# EAGLE design bus-wiring (EAGLE 5.11)
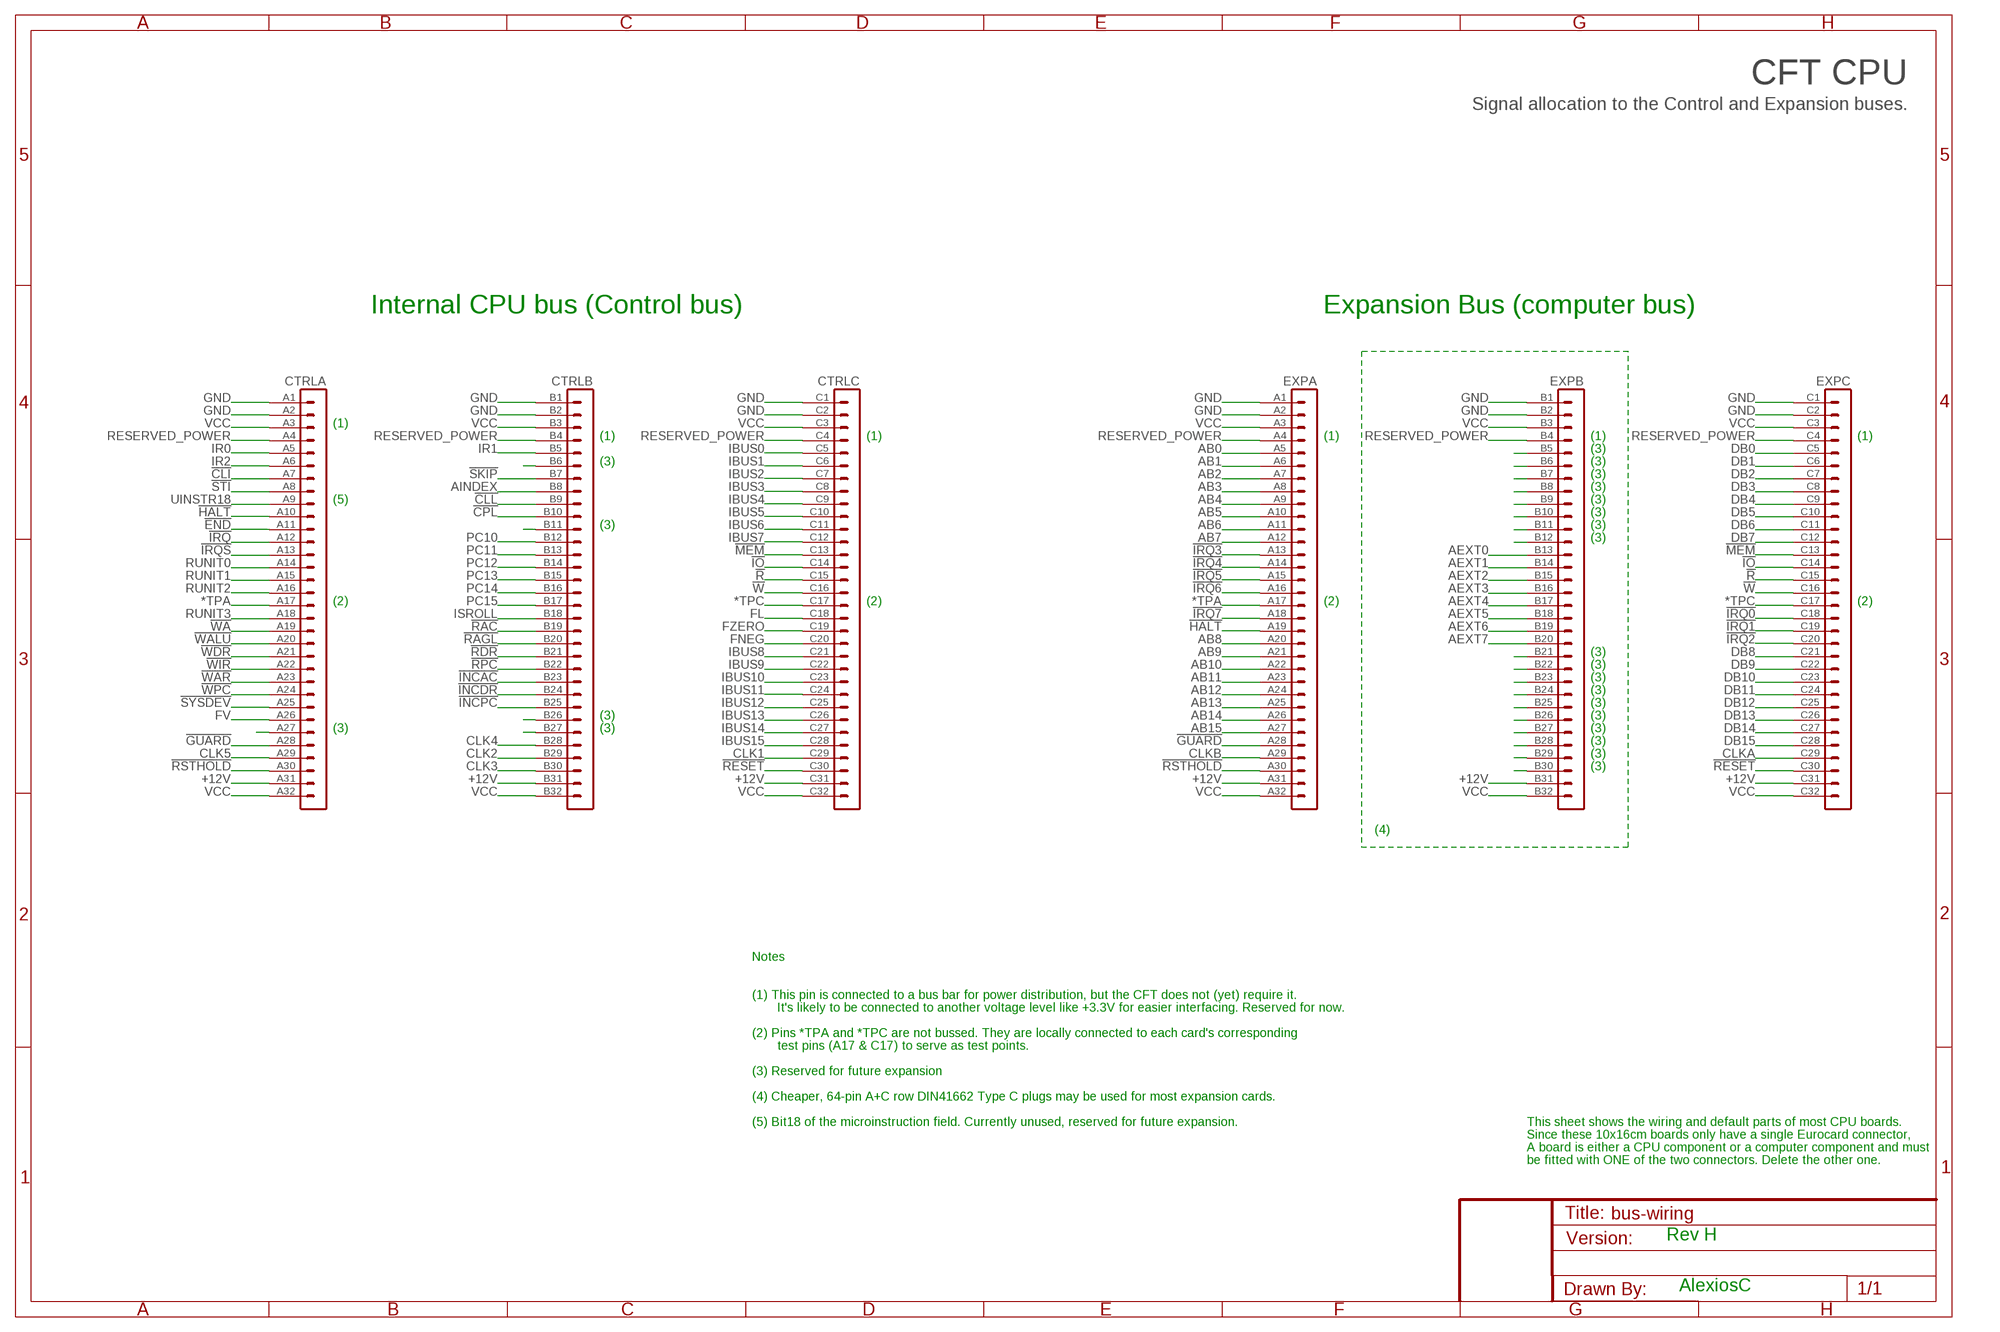
[diagram p0: schematic, sheet 1]

## Parts
CTRL  VG96-3B  [VG96B]
EXP  VG96-3B  [VG96B]

## Nets
!CLI: CTRL.A7
!CLL: CTRL.B9
!CPL: CTRL.B10
!END: CTRL.A11
!GUARD: CTRL.A28 EXP.A28
!HALT: CTRL.A10 EXP.A19
!INCAC: CTRL.B23
!INCDR: CTRL.B24
!INCPC: CTRL.B25
!IO: CTRL.C14 EXP.C14
!IRQ: CTRL.A12
!IRQ0: EXP.C18
!IRQ1: EXP.C19
!IRQ2: EXP.C20
!IRQ3: EXP.A13
!IRQ4: EXP.A14
!IRQ5: EXP.A15
!IRQ6: EXP.A16
!IRQ7: EXP.A18
!IRQS: CTRL.A13
!MEM: CTRL.C13 EXP.C13
!R: CTRL.C15 EXP.C15
!RAC: CTRL.B19
!RAGL: CTRL.B20
!RDR: CTRL.B21
!RESET: CTRL.C30 EXP.C30
!RPC: CTRL.B22
!RSTHOLD: CTRL.A30 EXP.A30
!SKIP: CTRL.B7
!STI: CTRL.A8
!SYSDEV: CTRL.A25
!W: CTRL.C16 EXP.C16
!WA: CTRL.A19
!WALU: CTRL.A20
!WAR: CTRL.A23
!WDR: CTRL.A21
!WIR: CTRL.A22
!WPC: CTRL.A24
*TPA: CTRL.A17 EXP.A17
*TPC: CTRL.C17 EXP.C17
+12V [12V]: CTRL.A31 CTRL.B31 CTRL.C31 EXP.A31 EXP.B31 EXP.C31
AB0: EXP.A5
AB1: EXP.A6
AB2: EXP.A7
AB3: EXP.A8
AB4: EXP.A9
AB5: EXP.A10
AB6: EXP.A11
AB7: EXP.A12
AB8: EXP.A20
AB9: EXP.A21
AB10: EXP.A22
AB11: EXP.A23
AB12: EXP.A24
AB13: EXP.A25
AB14: EXP.A26
AB15: EXP.A27
AEXT0: EXP.B13
AEXT1: EXP.B14
AEXT2: EXP.B15
AEXT3: EXP.B16
AEXT4: EXP.B17
AEXT5: EXP.B18
AEXT6: EXP.B19
AEXT7: EXP.B20
AINDEX: CTRL.B8
CLK1: CTRL.C29
CLK2: CTRL.B29
CLK3: CTRL.B30
CLK4: CTRL.B28
CLK5: CTRL.A29
CLKA: EXP.C29
CLKB: EXP.A29
DB0: EXP.C5
DB1: EXP.C6
DB2: EXP.C7
DB3: EXP.C8
DB4: EXP.C9
DB5: EXP.C10
DB6: EXP.C11
DB7: EXP.C12
DB8: EXP.C21
DB9: EXP.C22
DB10: EXP.C23
DB11: EXP.C24
DB12: EXP.C25
DB13: EXP.C26
DB14: EXP.C27
DB15: EXP.C28
FL: CTRL.C18
FNEG: CTRL.C20
FV: CTRL.A26
FZERO: CTRL.C19
GND: CTRL.A1 CTRL.A2 CTRL.B1 CTRL.B2 CTRL.C1 CTRL.C2 EXP.A1 EXP.A2 EXP.B1 EXP.B2 EXP.C1 EXP.C2
IBUS0: CTRL.C5
IBUS1: CTRL.C6
IBUS2: CTRL.C7
IBUS3: CTRL.C8
IBUS4: CTRL.C9
IBUS5: CTRL.C10
IBUS6: CTRL.C11
IBUS7: CTRL.C12
IBUS8: CTRL.C21
IBUS9: CTRL.C22
IBUS10: CTRL.C23
IBUS11: CTRL.C24
IBUS12: CTRL.C25
IBUS13: CTRL.C26
IBUS14: CTRL.C27
IBUS15: CTRL.C28
IR0: CTRL.A5
IR1: CTRL.B5
IR2: CTRL.A6
ISROLL: CTRL.B18
N$1: EXP.B12
N$2: EXP.B11
N$3: EXP.B10
N$4: EXP.B9
N$5: EXP.B8
N$8: EXP.B7
N$9: EXP.B6
N$10: EXP.B5
N$11: EXP.B28
N$12: EXP.B27
N$13: EXP.B26
N$15: EXP.B25
N$16: EXP.B24
N$17: EXP.B23
N$18: EXP.B22
N$19: EXP.B21
N$20: EXP.B29
N$21: EXP.B30
N$22: CTRL.B27
N$23: CTRL.B6
N$25: CTRL.A27
N$26: CTRL.B26
N$47: CTRL.B11
PC10: CTRL.B12
PC11: CTRL.B13
PC12: CTRL.B14
PC13: CTRL.B15
PC14: CTRL.B16
PC15: CTRL.B17
RESERVED_POWER: CTRL.A4 CTRL.B4 CTRL.C4 EXP.A4 EXP.B4 EXP.C4
RUNIT0: CTRL.A14
RUNIT1: CTRL.A15
RUNIT2: CTRL.A16
RUNIT3: CTRL.A18
UINSTR18: CTRL.A9
VCC: CTRL.A3 CTRL.A32 CTRL.B3 CTRL.B32 CTRL.C3 CTRL.C32 EXP.A3 EXP.A32 EXP.B3 EXP.B32 EXP.C3 EXP.C32

## Notes on the sheet
- CFT CPU
- Signal allocation to the Control and Expansion buses.
- Internal CPU bus (Control bus) | Expansion Bus (computer bus)
- (1)
- (1) | (1) | (1) | (1) | (1)
- (3)
- (3) | (3)
- (3)
- (3)
- (5) | (3)
- (3)
- (3) | (3)
- (3)
- (2) | (2) | (2) | (2)
- (3)
- (3)
- (3)
- (3)
- (3)
- (3) | (3)
- (3) | (3) | (3)
- (3)
- (3)
- (3)
- (4)
- Notes
- (1) This pin is connected to a bus bar for power distribution, but the CFT does not (yet) require it.
- It's likely to be connected to another voltage level like +3.3V for easier interfacing. Reserved for now.
- (2) Pins *TPA and *TPC are not bussed. They are locally connected to each card's corresponding
- test pins (A17 & C17) to serve as test points.
- (3) Reserved for future expansion
- (4) Cheaper, 64-pin A+C row DIN41662 Type C plugs may be used for most expansion cards.
- (5) Bit18 of the microinstruction field. Currently unused, reserved for future expansion. | This sheet shows the wiring and default parts of most CPU boards.
- Since these 10x16cm boards only have a single Eurocard connector,
- A board is either a CPU component or a computer component and must
- be fitted with ONE of the two connectors. Delete the other one.
- Rev H
- AlexiosC

## Library data of the parts
CTRL EXP = 19inch:VG96-3: PCB EUROCARD, 96-pin type C/ABC, 2.54 mm

## Net classes
0 default: width 0.305 mm, clearance 0.254 mm
1 Power: width 0.635 mm, clearance 0.254 mm
2 12V: width 0.635 mm, clearance 0.635 mm

## Board
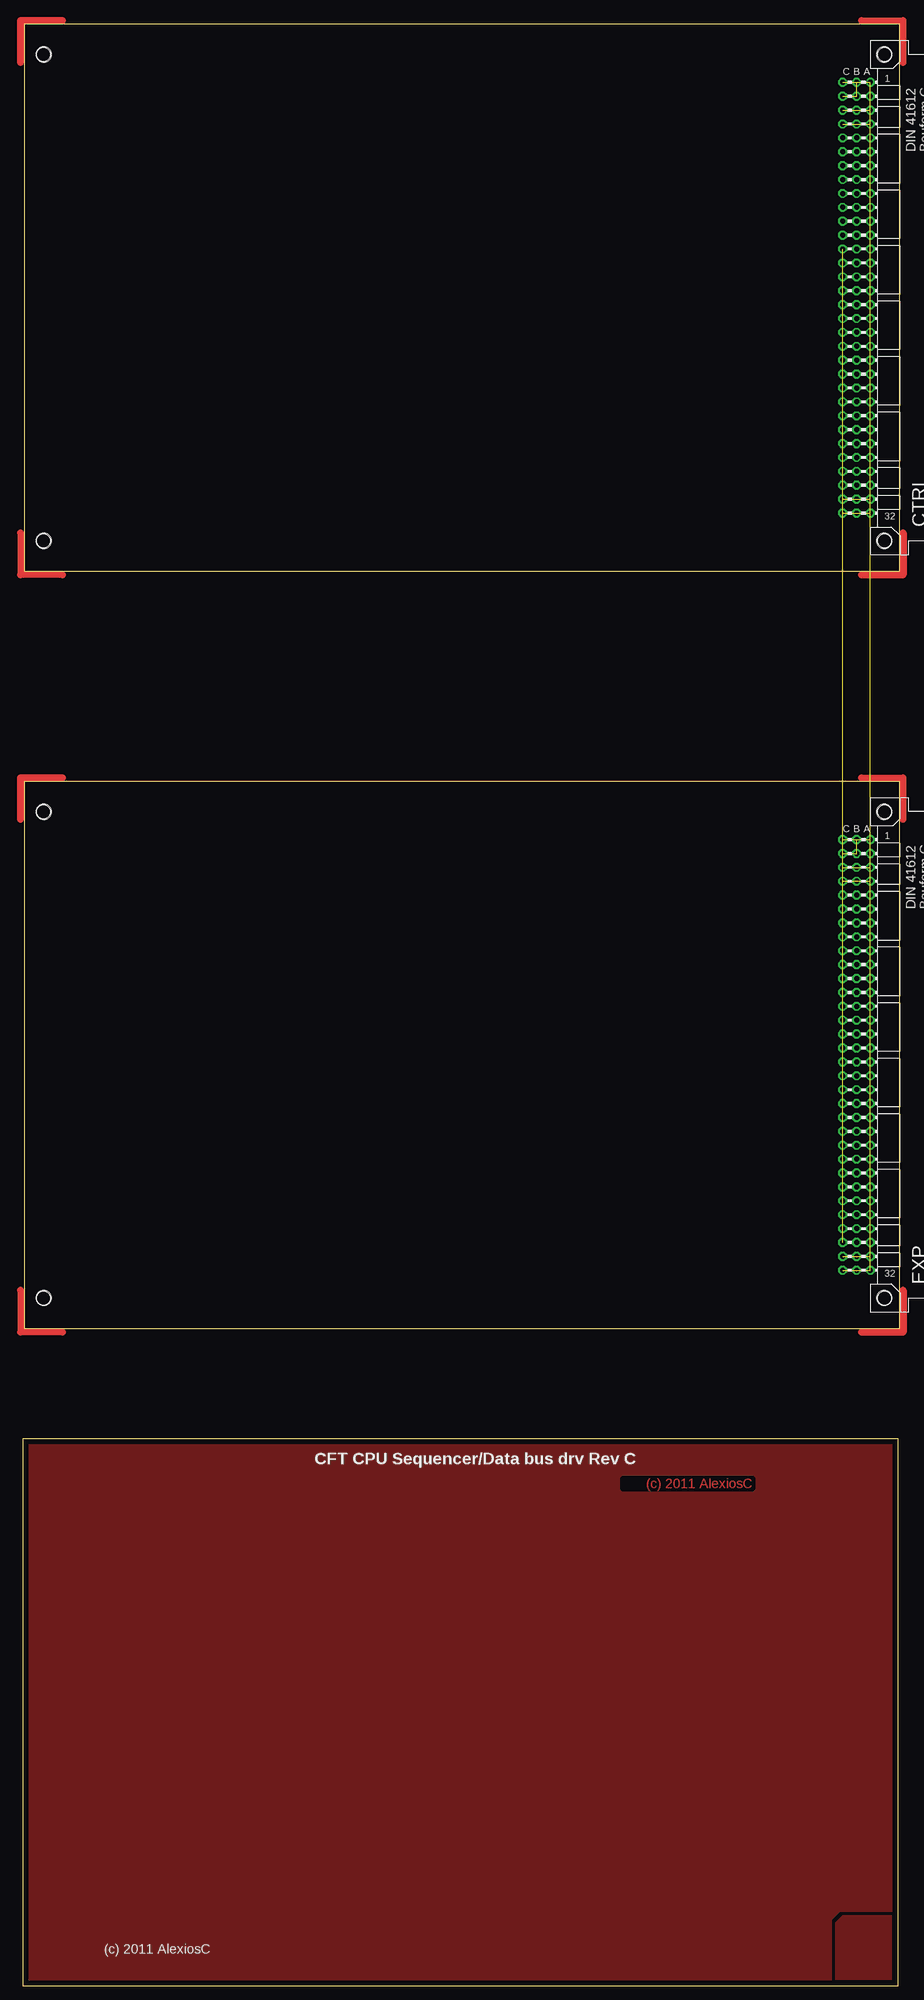
[diagram p1: board, top side]
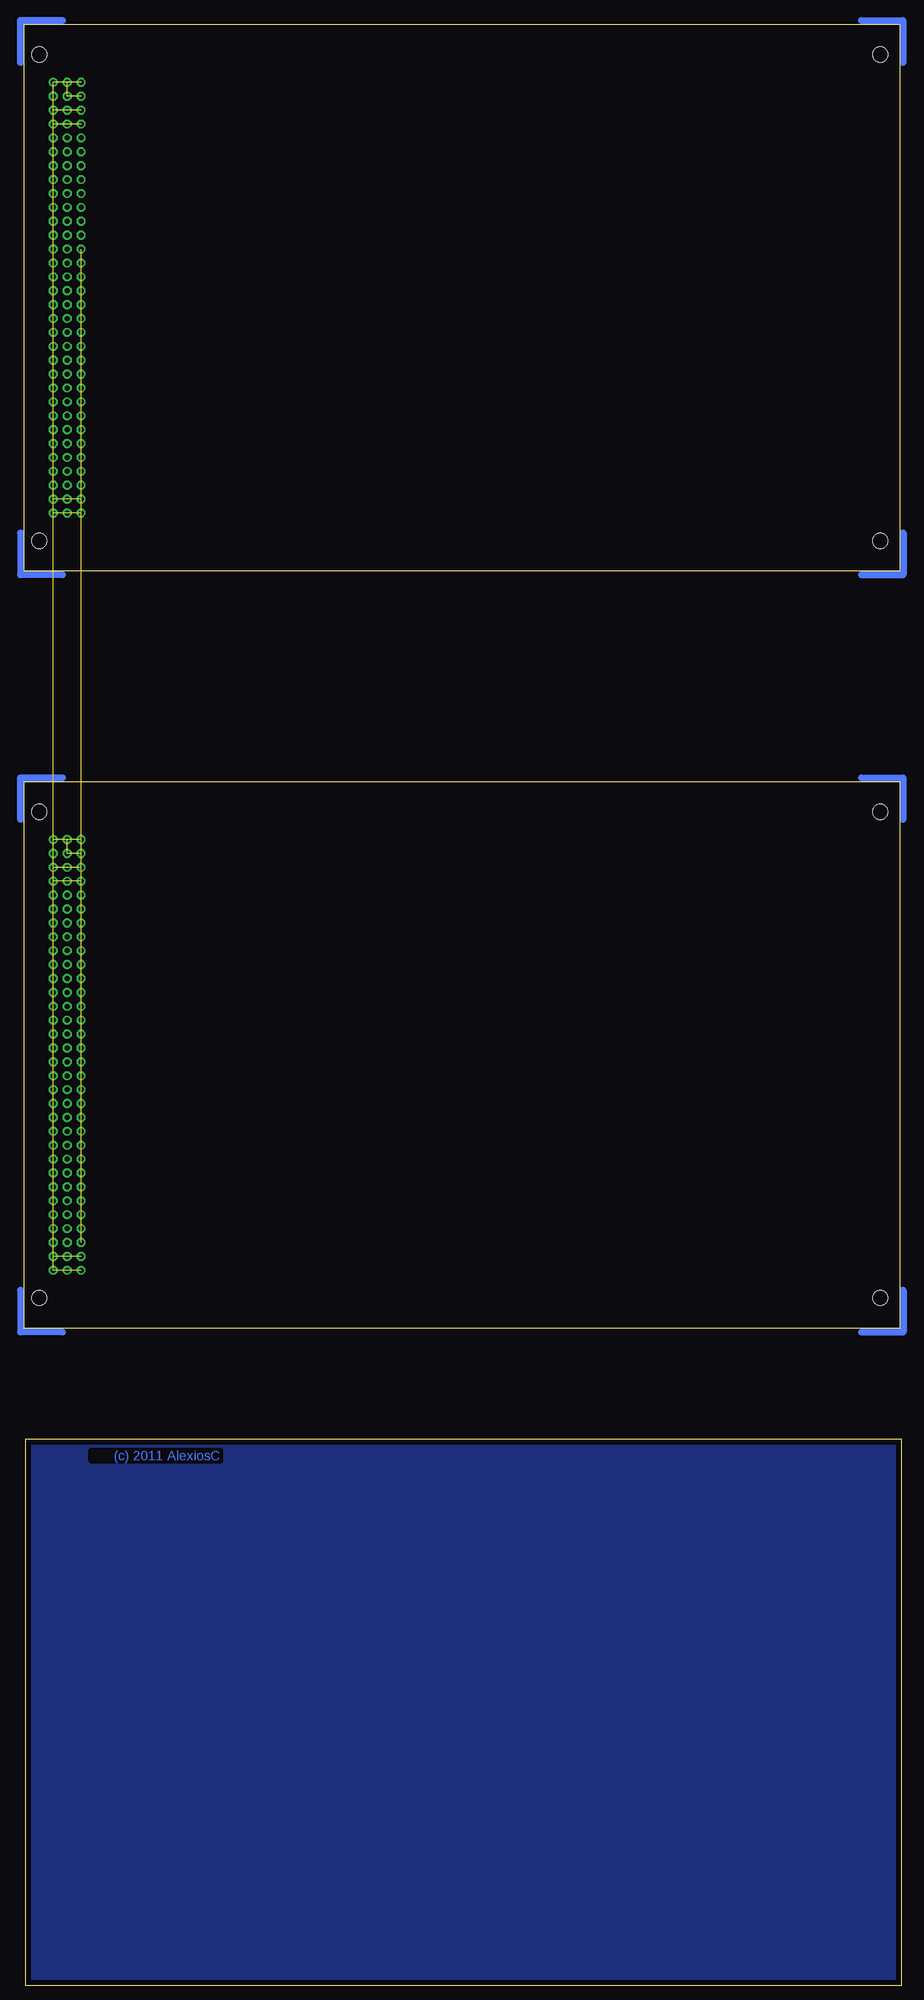
[diagram p2: board, bottom side, seen from below]

Size 160.27 x 358.62 mm. Coordinates in mm from the lower left corner, seen from the top.
Outline: 0,0 160,0 160,100 0,100 0,0
Copper layers (1*16): Top 0.035mm / dielectric 1.5mm / Bottom 0.035mm
Design rules "olimex-10mil": minimum track width 10mil, minimum drill 24mil, track to track 10mil, track to pad 10mil, pad to pad 10mil, via to via 10mil, smd to smd 10mil, copper to edge 40mil, drill to drill 10mil, minimum pad ring 10mil, minimum via ring 8mil, stop-mask expansion 0mil, vias tented up to drill 0mil, thermal gap 10mil

### Footprints (pad centres in the part's own frame; a part is rotated, then mirrored left to right if it is on the bottom)
VG96B = drill 0.914 pad 1.6 round: A1 154.94,39.37 | drill 0.914 pad 1.6 octagon: A2 154.94,36.83; A3 154.94,34.29; A4 154.94,31.75; A5 154.94,29.21; A6 154.94,26.67; A7 154.94,24.13; A8 154.94,21.59; A9 154.94,19.05; A10 154.94,16.51; A11 154.94,13.97; A12 154.94,11.43; A13 154.94,8.89; A14 154.94,6.35; A15 154.94,3.81; A16 154.94,1.27; A17 154.94,-1.27; A18 154.94,-3.81; A19 154.94,-6.35; A20 154.94,-8.89; A21 154.94,-11.43; A22 154.94,-13.97; A23 154.94,-16.51; A24 154.94,-19.05; A25 154.94,-21.59; A26 154.94,-24.13; A27 154.94,-26.67; A28 154.94,-29.21; A29 154.94,-31.75; A30 154.94,-34.29; A31 154.94,-36.83; A32 154.94,-39.37; B1 152.4,39.37; B2 152.4,36.83; B3 152.4,34.29; B4 152.4,31.75; B5 152.4,29.21; B6 152.4,26.67; B7 152.4,24.13; B8 152.4,21.59; B9 152.4,19.05; B10 152.4,16.51; B11 152.4,13.97; B12 152.4,11.43; B13 152.4,8.89; B14 152.4,6.35; B15 152.4,3.81; B16 152.4,1.27; B17 152.4,-1.27; B18 152.4,-3.81; B19 152.4,-6.35; B20 152.4,-8.89; B21 152.4,-11.43; B22 152.4,-13.97; B23 152.4,-16.51; B24 152.4,-19.05; B25 152.4,-21.59; B26 152.4,-24.13; B27 152.4,-26.67; B28 152.4,-29.21; B29 152.4,-31.75; B30 152.4,-34.29; B31 152.4,-36.83; B32 152.4,-39.37; C1 149.86,39.37; C2 149.86,36.83; C3 149.86,34.29; C4 149.86,31.75; C5 149.86,29.21; C6 149.86,26.67; C7 149.86,24.13; C8 149.86,21.59; C9 149.86,19.05; C10 149.86,16.51; C11 149.86,13.97; C12 149.86,11.43; C13 149.86,8.89; C14 149.86,6.35; C15 149.86,3.81; C16 149.86,1.27; C17 149.86,-1.27; C18 149.86,-3.81; C19 149.86,-6.35; C20 149.86,-8.89; C21 149.86,-11.43; C22 149.86,-13.97; C23 149.86,-16.51; C24 149.86,-19.05; C25 149.86,-21.59; C26 149.86,-24.13; C27 149.86,-26.67; C28 149.86,-29.21; C29 149.86,-31.75; C30 149.86,-34.29; C31 149.86,-36.83; C32 149.86,-39.37 | hole 2.794: 157.48,44.45; 157.48,-44.45; 3.81,44.45; 3.81,-44.45

### Placement (x,y rotation side)
CTRL  0,308.61 0 top
EXP  0,170.18 0 top

### Tracks (layer width: path | path; a pad name or v marks a point on that pad's centre or on a via)
!GUARD  (1 unrouted)
!HALT  (1 unrouted)
!IO  (1 unrouted)
!MEM  (1 unrouted)
!R  (1 unrouted)
!RESET  (1 unrouted)
!RSTHOLD  (1 unrouted)
!W  (1 unrouted)
*TPA  (1 unrouted)
*TPC  (1 unrouted)
+12V  (5 unrouted)
  pour Top (isolate 0.635, no thermals): 148.59,11.43 148.59,1.27 158.75,1.27 158.75,12.7 149.86,12.7
GND  (11 unrouted)
  pour Bottom (isolate 0.508, no thermals): 30.48,8.89 29.21,7.62 29.21,5.08 30.48,3.81 33.02,3.81 34.29,5.08 34.29,7.62 33.02,8.89
  pour Bottom (isolate 0.61, no thermals): 0,100.33 0,0 160.02,0 160.02,100.33
RESERVED_POWER  (5 unrouted)
VCC  (11 unrouted)
  pour Top (isolate 0.508, no thermals): 20.32,8.89 19.05,7.62 19.05,5.08 20.32,3.81 22.86,3.81 24.13,5.08 24.13,7.62 22.86,8.89
  pour Top (isolate 0.61, rank 2, no thermals): 0,100.33 0,0 160.02,0 160.02,100.33

### Text on the board
Top: (c) 2011 AlexiosC
Bottom: (c) 2011 AlexiosC
tNames: CFT CPU Sequencer/Data bus drv Rev C | (c) 2011 AlexiosC
tValues: +12V | +5V | GND